# Altium schematic sheet Drivers.SchDoc
size A4; SheetNumber: 1; SheetTotal: 3
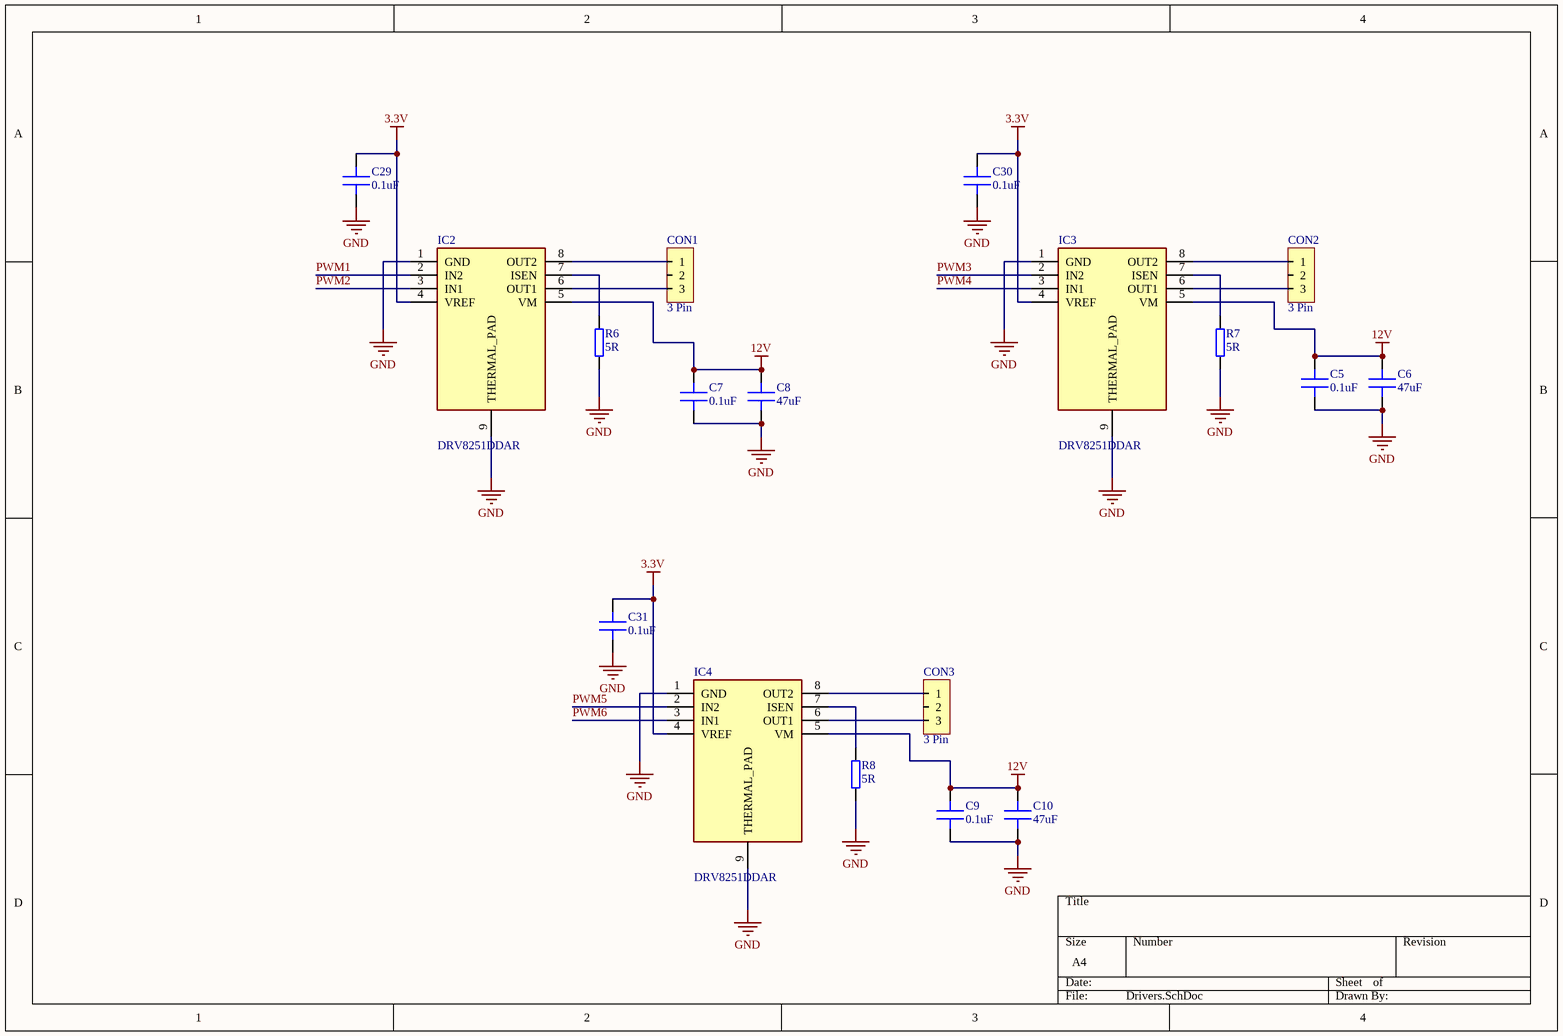
[diagram p0: Drivers.SchDoc]

## Parts
C5  0.1uF  [C 0402]
C6  47uF  [C 1206]
C7  0.1uF  [C 0402]
C8  47uF  [C 1206]
C9  0.1uF  [C 0402]
C10  47uF  [C 1206]
C29  0.1uF  [C 0402]
C30  0.1uF  [C 0402]
C31  0.1uF  [C 0402]
CON1  3 Pin  [BM03B-SRSS-TB]
CON2  3 Pin  [BM03B-SRSS-TB]
CON3  3 Pin  [BM03B-SRSS-TB]
IC2  DRV8251DDAR  [SOIC127P600X170-9N]
IC3  DRV8251DDAR  [SOIC127P600X170-9N]
IC4  DRV8251DDAR  [SOIC127P600X170-9N]
R6  5R  [R 1206]
R7  5R  [R 1206]
R8  5R  [R 1206]

## Nets
3.3V: C29.1 C30.1 C31.1 IC2.4(VREF) IC3.4(VREF) IC4.4(VREF)
12V: C5.1 C6.1 C7.1 C8.1 C9.1 C10.1 IC2.5(VM) IC3.5(VM) IC4.5(VM)
GND: C5.2 C6.2 C7.2 C8.2 C9.2 C10.2 C29.2 C30.2 C31.2 IC2.1(GND) IC2.9(THERMAL_PAD) IC3.1(GND) IC3.9(THERMAL_PAD) IC4.1(GND) IC4.9(THERMAL_PAD) R6.1 R7.1 R8.1
PWM1: IC2.2(IN2)
PWM2: IC2.3(IN1)
PWM3: IC3.2(IN2)
PWM4: IC3.3(IN1)
PWM5: IC4.2(IN2)
PWM6: IC4.3(IN1)
NetCON1_1: CON1.1 IC2.8(OUT2)
NetCON1_3: CON1.3 IC2.6(OUT1)
NetCON2_1: CON2.1 IC3.8(OUT2)
NetCON2_3: CON2.3 IC3.6(OUT1)
NetCON3_1: CON3.1 IC4.8(OUT2)
NetCON3_3: CON3.3 IC4.6(OUT1)
NetIC2_7: IC2.7(ISEN) R6.2
NetIC3_7: IC3.7(ISEN) R7.2
NetIC4_7: IC4.7(ISEN) R8.2

Not connected (* = marked no-connect by the designer): CON1 2; CON2 2; CON3 2

## Library data of the parts
C5-C10 C29-C31 = Capacitor: MLCC Capacitor
IC2-IC4 = DRV8251DDAR: Integrated Circuit; Manufacturer_Name: Texas Instruments; Datasheet Link: https://www.arrow.com/en/products/drv8251ddar/texas-instruments?region=nac; Height: 1.7mm; Manufacturer_Part_Number: DRV8251DDAR; Mouser Part Number: 595-DRV8251DDAR; Mouser Price/Stock: https://www.mouser.co.uk/ProductDetail/Texas-Instruments/DRV8251DDAR?qs=doiCPypUmgHTzZyfapGahQ%3D%3D; Arrow Part Number: DRV8251DDAR; Arrow Price/Stock: https://www.arrow.com/en/products/drv8251ddar/texas-instruments?region=nac
R6-R8 = Resistor: General pourpouse resistor